# EAGLE design Flip-Flop (EAGLE 9.6.2)
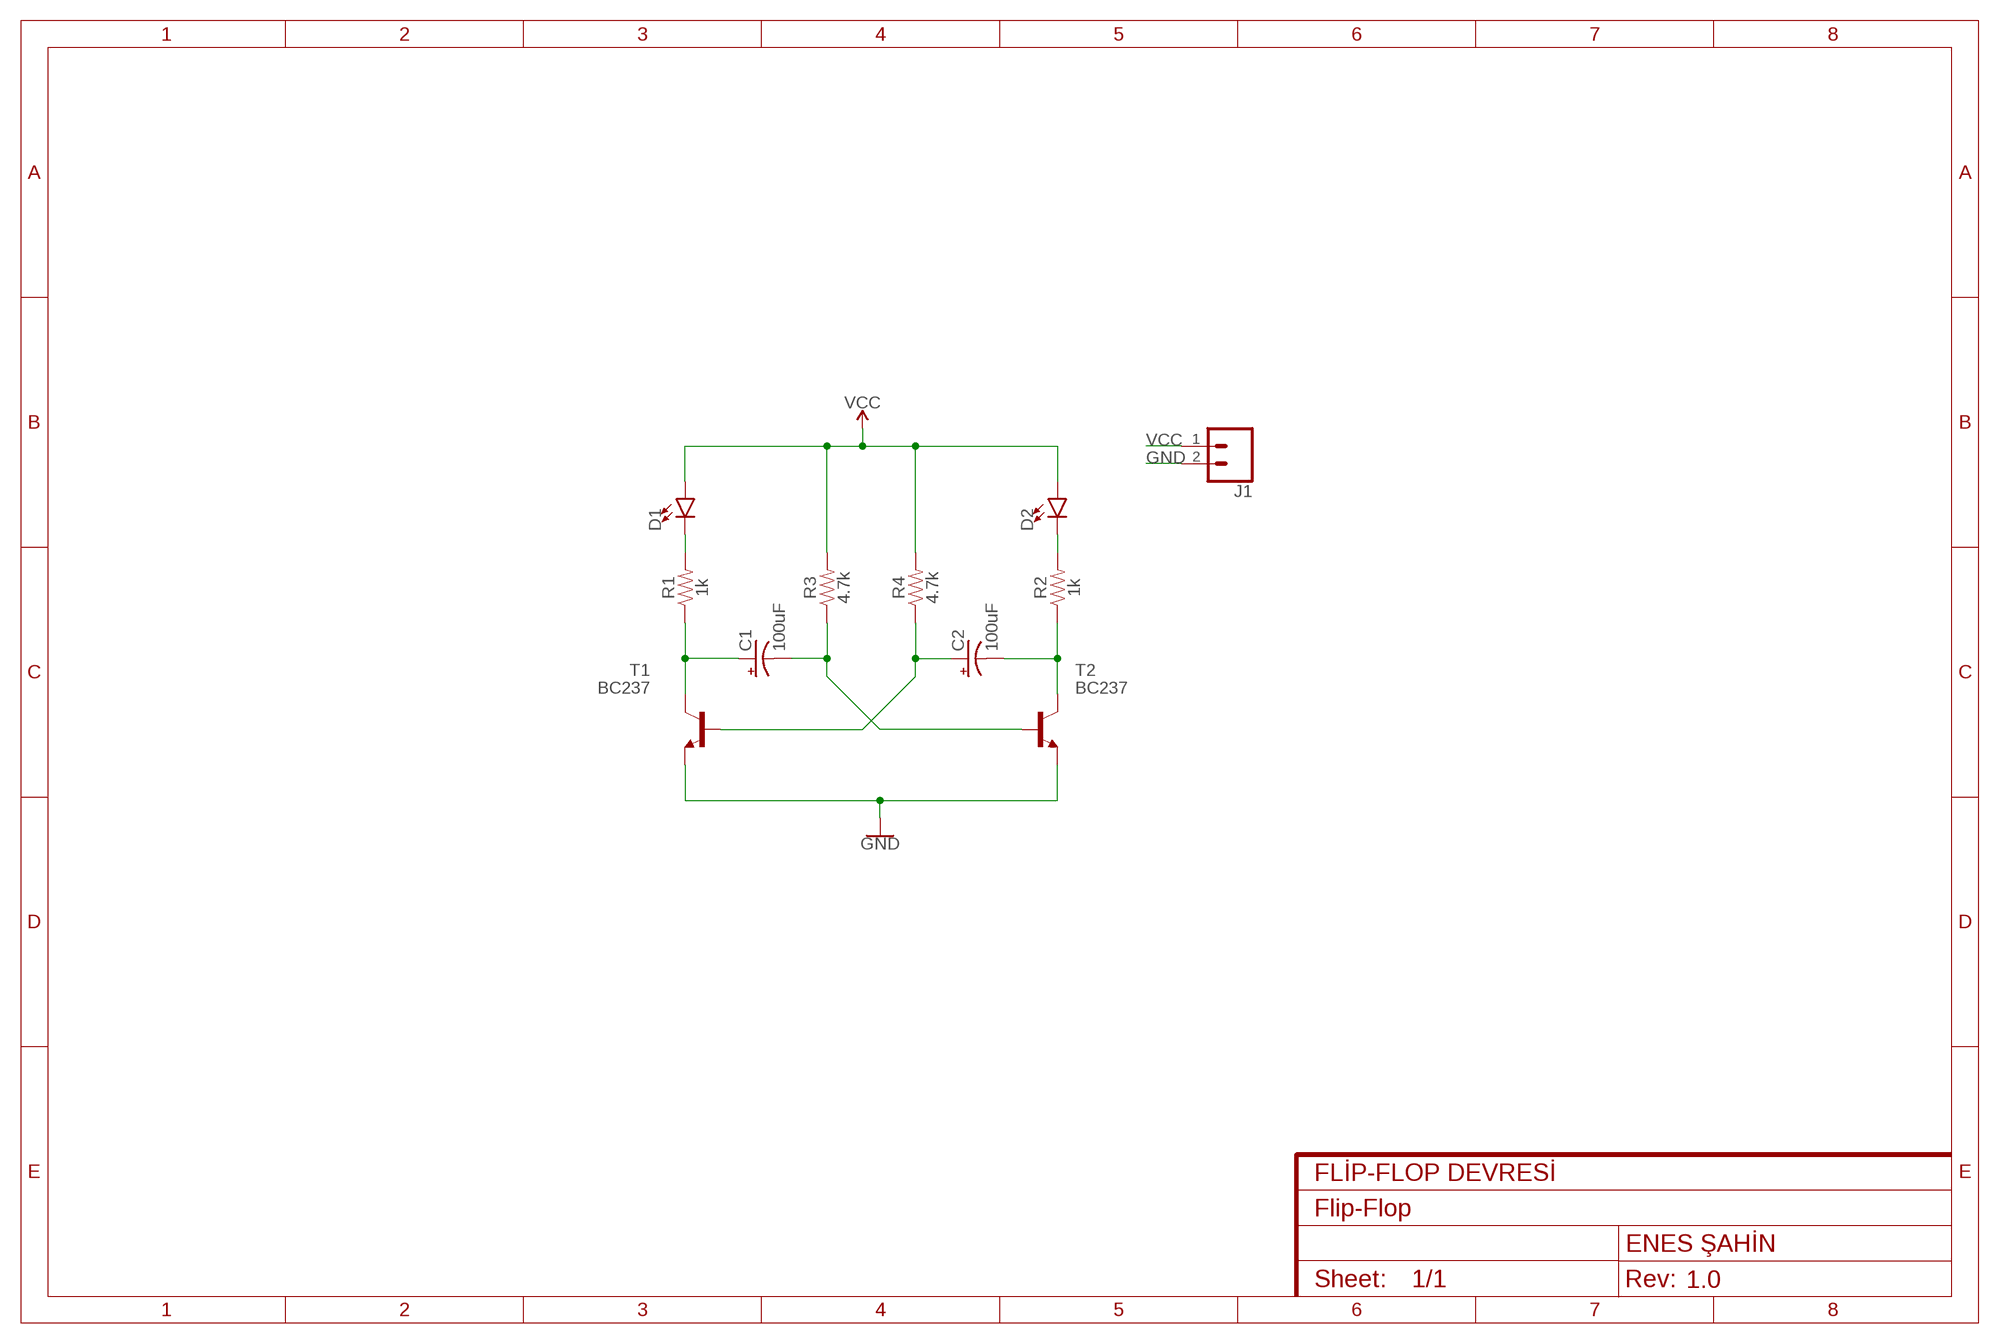
[diagram p0: schematic, sheet 1]
FRAME1 (FRAME-A4L): CNAME: FLİP-FLOP DEVRESİ; CREVISION: 1.0; DESIGNER: ENES ŞAHİN

## Parts
C1  100uF  100UF-POLAR-RADIAL-2.5MM-25V-20%  [CPOL-RADIAL-2.5MM-6.5MM]
C2  100uF  100UF-POLAR-RADIAL-2.5MM-25V-20%  [CPOL-RADIAL-2.5MM-6.5MM]
D1  LED-3MM-NO_SILK  [LED_3MM-NS]
D2  LED-3MM-NO_SILK  [LED_3MM-NS]
J1  CONN_02  [1X02]
R1  1k  1KOHM-HORIZ-1/4W-1%  [AXIAL-0.3]
R2  1k  1KOHM-HORIZ-1/4W-1%  [AXIAL-0.3]
R3  4.7k  1KOHM-HORIZ-1/4W-1%  [AXIAL-0.3]
R4  4.7k  1KOHM-HORIZ-1/4W-1%  [AXIAL-0.3]
T1  BC237  [TO92]
T2  BC237  [TO92]

## Nets
GND: J1.2 T1.1(E) T2.1(E)
N$1: D1.K(C) R1.P$2
N$2: C1.1(+) R1.P$1 T1.3(C)
N$3: D2.K(C) R2.P$2
N$5: C1.2(-) R3.P$1 T2.2(B)
N$6: C2.1(+) R4.P$1 T1.2(B)
N$7: C2.2(-) R2.P$1 T2.3(C)
VCC: D1.A D2.A J1.1 R3.P$2 R4.P$2

## Library data of the parts
C1 C2 = SparkFun-Capacitors:100UF-POLAR: 100µF polarized capacitors A capacitor is a passive two-terminal electrical component used to store electrical energy temporarily in an electric field.; PROD_ID: CAP-08439
D1 D2 = SparkFun-LED:LED: LED (Generic) Standard schematic elements and footprints for 5mm, 3mm, 1206, and 0603 sized LEDs. Generic LEDs with no color specified.
J1 = SparkFun-Connectors:CONN_02: Multi connection point. Often used as Generic Header-pin footprint for 0.1 inch spaced/style header connections On any of the 0.1 inch spaced packages, you can populate with these: Break Away Headers - Straight <https://www.sparkfun.com/products/116> (PRT-00116) Break Away Male Headers - Right Angle <https://www.sparkfun.com/products/553> (PRT-00553) Female Headers <https://www.sparkfun.com/products/115> (PRT-00115) Break Away Headers - Machine Pin <https://www.sparkfun.com/products/117> (PRT-00117) Break Away Female Headers - Swiss Machine Pin <https://www.sparkfun.com/products/743> (PRT-00743) For SCREWTERMINALS and SPRING TERMINALS visit here: Screw Terimnals on SparkFun.com <https://www.sparkfun.com/search/results?term=Screw+Terminals> (5mm/3.5mm/2.54mm spacing) This device is also useful as a general connection point to wire up your design to another part of your project. Our various solder wires solder well into these plated through hole pads. Hook-Up Wire - Assortment (Stranded, 22 AWG) <https://www.sparkfun.com/products/11375> (PRT-11375) Hook-Up Wire - Assortment (Solid Core, 22 AWG) <https://www.sparkfun.com/products/11367> (PRT-11367) View the entire wire category on our website here <https://www.sparkfun.com/categories/141> Special notes: Molex polarized connector foot print use with: PRT-08233 with associated crimp pins and housings. 2.54_SCREWTERM for use with PRT-10571. 3.5mm Screw Terminal footprints for PRT-08084 5mm Screw Terminal footprints for use with PRT-08432
R1 R2 = SparkFun-Resistors:1KOHM: 1kΩ resistor A resistor is a passive two-terminal electrical component that implements electrical resistance as a circuit element. Resistors act to reduce current flow, and, at the same time, act to lower voltage levels within circuits. - Wikipedia; PROD_ID: RES-12182
R3 R4 = SparkFun-Resistors:1KOHM: 1kΩ resistor A resistor is a passive two-terminal electrical component that implements electrical resistance as a circuit element. Resistors act to reduce current flow, and, at the same time, act to lower voltage levels within circuits. - Wikipedia; PROD_ID: RES-12182; VALUE: 1k
T1 T2 = transistor:BC237: NPN TRANSISTOR

## Board
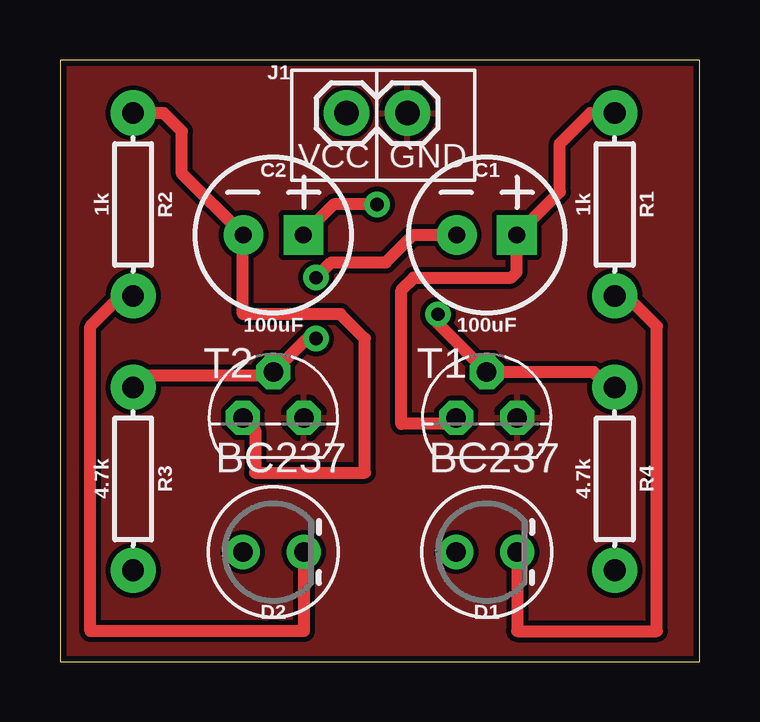
[diagram p1: board, top side]
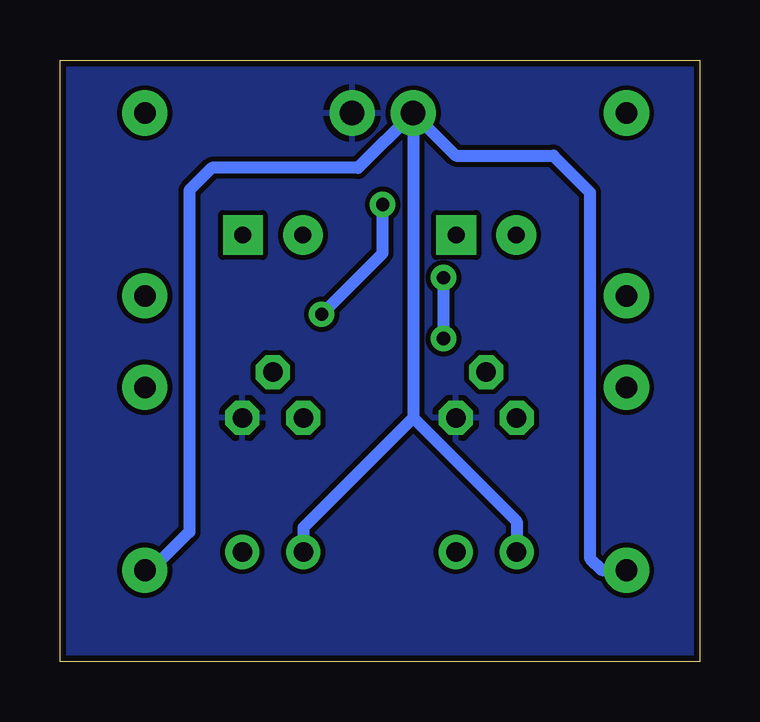
[diagram p2: board, bottom side, seen from below]

Size 26.65 x 25.07 mm. Coordinates in mm from the lower left corner, seen from the top.
Outline: 0,0 26.65,0 26.65,25.07 0,25.07 0,0
Copper layers (1*16): Top 0.035mm / dielectric 1.5mm / Bottom 0.035mm
Design rules "SparkFun": minimum track width 8mil, minimum drill 20mil, track to track 8mil, track to pad 8mil, pad to pad 8mil, via to via 8mil, smd to smd 8mil, copper to edge 10mil, drill to drill 8mil, minimum pad ring 12mil, minimum via ring 10mil, stop-mask expansion 4mil, vias tented up to drill 25mil, thermal gap 10mil

### Footprints (pad centres in the part's own frame; a part is rotated, then mirrored left to right if it is on the bottom)
CPOL-RADIAL-2.5MM-6.5MM = drill 0.7 pad 1.651 square: 1 1.25,0 | drill 0.7 pad 1.651: 2 -1.25,0
LED_3MM-NS = drill 0.813: A -1.27,0; K 1.27,0
1X02 = drill 1.016 pad 1.88: 1 0,0; 2 2.54,0
AXIAL-0.3 = drill 0.9 pad 1.88: P$1 -3.81,0; P$2 3.81,0
TO92 = drill 0.813 octagon: 1 1.27,0; 2 0,1.905; 3 -1.27,0

### Placement (x,y rotation side)
C1  17.78,17.78 0 top
C2  8.89,17.78 0 top
D1  17.78,4.57 0 top
D2  8.89,4.57 0 top
J1  11.94,22.86 0 top
R1  23.11,19.05 270 top
R2  3.05,19.05 270 top
R3  3.05,7.62 270 top
R4  23.11,7.62 270 top
T1  17.78,10.16 0 top
T2  8.89,10.16 0 top

### Tracks (layer width: path | path; a pad name or v marks a point on that pad's centre or on a via)
GND
  pour Top: -0.51,25.65 27.43,25.65 27.43,-0.76 -1.02,-0.76 -1.02,25.65
  pour Bottom: -1.52,26.16 27.94,26.16 27.94,-1.27 -1.52,-1.27
N$1
  Top 0.508: D1.K 19.05,1.27 24.87,1.27 24.87,13.97 23.6,15.24 R1.P$2
N$2
  Top 0.508: R1.P$1 22.1,22.86 20.83,21.59 20.83,19.58 C1.1 19.03,16.24 18.8,16 14.73,16 14.22,15.49 14.22,9.91 16.26,9.91 T1.3
N$3
  Top 0.508: D2.K 10.16,1.27 1.27,1.27 1.27,13.97 2.54,15.24 R2.P$2
N$5  (via drill 0.55)
  Top 0.508: R3.P$1 3.56,11.94 8.76,11.94 T2.2 10.29,13.46 v10.67,13.46 | C1.2 14.71,17.78 13.57,16.64 11.31,16.64 v10.67,16
  Bottom 0.508: v10.67,13.46 v10.67,16
N$6  (via drill 0.55)
  Top 0.508: R4.P$1 22.86,11.43 22.23,12.06 T1.2 15.75,14.1 v15.75,14.48 | C2.1 11.41,19.05 v13.21,19.05
  Bottom 0.508: v15.75,14.48 13.21,17.02 v13.21,19.05
N$7
  Top 0.508: T2.3 8.13,9.65 8.13,7.87 12.7,7.87 12.7,13.46 11.68,14.48 7.62,14.48 7.62,17.76 C2.2 5.08,20.34 5.08,22.1 4.32,22.86 R2.P$1
VCC
  Bottom 0.508: J1.1 11.94,10.16 | D1.A 16.51,5.59 11.94,10.16 | 11.94,10.16 7.62,5.84 D2.A | J1.1 10.16,21.08 6.1,21.08 4.57,19.56 4.57,4.32 4.06,3.81 R3.P$2 | J1.1 14.22,20.57 20.32,20.57 21.26,19.63 21.26,5.41 22.86,3.81 R4.P$2

### Text on the board
tNames: VCC | GND